# Altium schematic sheet Input_MCU.SchDoc: Input_MCU
size 420 x 297 mm; Author: T. Ludemann; SheetNumber: 1; SheetTotal: 4; DocSize: DINA3
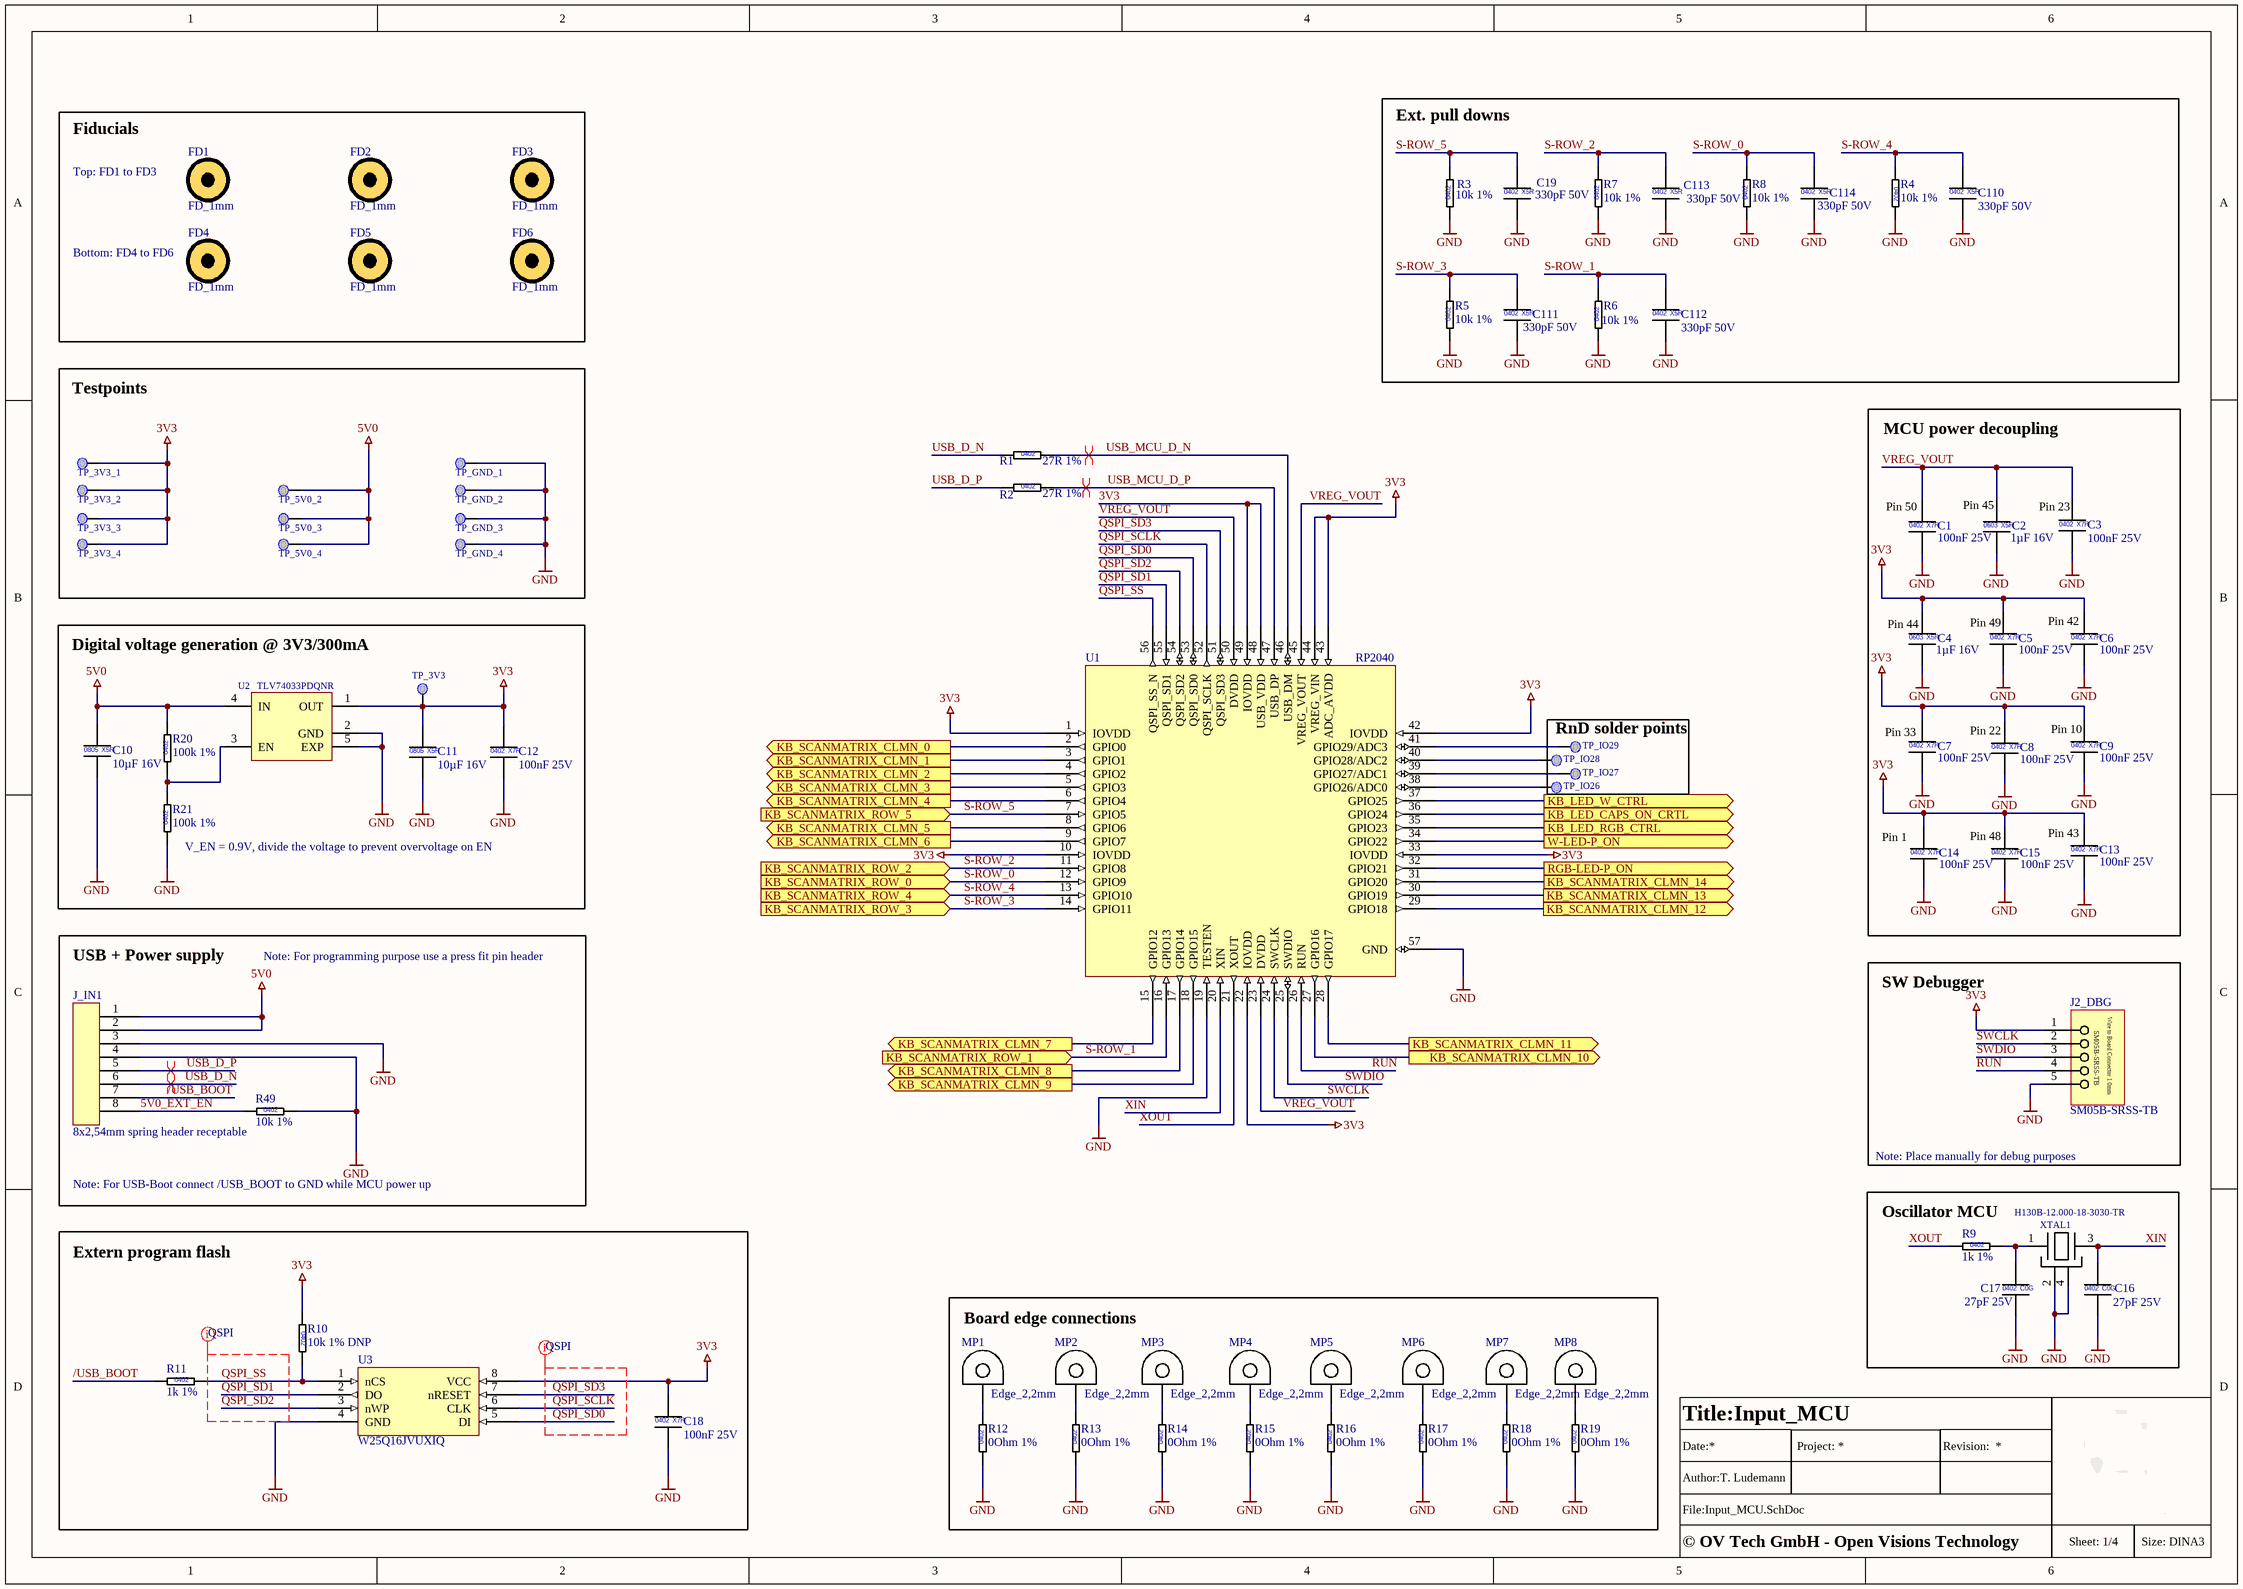
[diagram p0: Input_MCU.SchDoc]

## Parts
?  (no value)  (graphical)
C1  100nF 25V  [CAPC1005X06L]
C2  1µF 16V  [CAPC1608X10L]
C3  100nF 25V  [CAPC1005X06L]
C4  1µF 16V  [CAPC1608X10L]
C5  100nF 25V  [CAPC1005X06L]
C6  100nF 25V  [CAPC1005X06L]
C7  100nF 25V  [CAPC1005X06L]
C8  100nF 25V  [CAPC1005X06L]
C9  100nF 25V  [CAPC1005X06L]
C10  10µF 16V  [CAPC2012X14L]
C11  10µF 16V  [CAPC2012X14L]
C12  100nF 25V  [CAPC1005X06L]
C13  100nF 25V  [CAPC1005X06L]
C14  100nF 25V  [CAPC1005X06L]
C15  100nF 25V  [CAPC1005X06L]
C16  27pF 25V  [CAPC1005X06L]
C17  27pF 25V  [CAPC1005X06L]
C18  100nF 25V  [CAPC1005X06L]
C19  330pF 50V  [CAPC1005X06L]
C110  330pF 50V  [CAPC1005X06L]
C111  330pF 50V  [CAPC1005X06L]
C112  330pF 50V  [CAPC1005X06L]
C113  330pF 50V  [CAPC1005X06L]
C114  330pF 50V  [CAPC1005X06L]
FD1  FD_1mm  [FD_1mm_Copper_3mm_Expansion]  (no BOM)
FD2  FD_1mm  [FD_1mm_Copper_3mm_Expansion]  (no BOM)
FD3  FD_1mm  [FD_1mm_Copper_3mm_Expansion]  (no BOM)
FD4  FD_1mm  [FD_1mm_Copper_3mm_Expansion]  (no BOM)
FD5  FD_1mm  [FD_1mm_Copper_3mm_Expansion]  (no BOM)
FD6  FD_1mm  [FD_1mm_Copper_3mm_Expansion]  (no BOM)
J2_DBG  SM05B-SRSS-TB  [Wire-to-Board SM05B-SRSS-TB]
J_IN1  8x2,54mm spring header receptable  [BOARD-BOARD CON SPRING-LOADED HEADER 8x2,54mm Receptable]  (no BOM)
MP1  Edge_2,2mm  [MP_Keyboard_EdgeMounts_2.2mm]  (no BOM)
MP2  Edge_2,2mm  [MP_Keyboard_EdgeMounts_2.2mm]  (no BOM)
MP3  Edge_2,2mm  [MP_Keyboard_EdgeMounts_2.2mm]  (no BOM)
MP4  Edge_2,2mm  [MP_Keyboard_EdgeMounts_2.2mm]  (no BOM)
MP5  Edge_2,2mm  [MP_Keyboard_EdgeMounts_2.2mm]  (no BOM)
MP6  Edge_2,2mm  [MP_Keyboard_EdgeMounts_2.2mm]  (no BOM)
MP7  Edge_2,2mm  [MP_Keyboard_EdgeMounts_2.2mm]  (no BOM)
MP8  Edge_2,2mm  [MP_Keyboard_EdgeMounts_2.2mm]  (no BOM)
R1  27R 1%  [RESC1005X04L]
R2  27R 1%  [RESC1005X04L]
R3  10k 1%  [RESC1005X04L]
R4  10k 1%  [RESC1005X04L]
R5  10k 1%  [RESC1005X04L]
R6  10k 1%  [RESC1005X04L]
R7  10k 1%  [RESC1005X04L]
R8  10k 1%  [RESC1005X04L]
R9  1k 1%  [RESC1005X04L]
R10  10k 1% DNP  [RESC1005X04L]
R11  1k 1%  [RESC1005X04L]
R12  0Ohm 1%  [RESC1005X04L]
R13  0Ohm 1%  [RESC1005X04L]
R14  0Ohm 1%  [RESC1005X04L]
R15  0Ohm 1%  [RESC1005X04L]
R16  0Ohm 1%  [RESC1005X04L]
R17  0Ohm 1%  [RESC1005X04L]
R18  0Ohm 1%  [RESC1005X04L]
R19  0Ohm 1%  [RESC1005X04L]
R20  100k 1%  [RESC1005X04L]
R21  100k 1%  [RESC1005X04L]
R49  10k 1%  [RESC1005X04L]
TP_3V3  Testpoint 0.75mm  [TP_0.75mm]  (value not drawn)  (no BOM)
TP_3V3_1  Testpoint 0.75mm  [TP_0.75mm]  (value not drawn)  (no BOM)
TP_3V3_2  Testpoint 0.75mm  [TP_0.75mm]  (value not drawn)  (no BOM)
TP_3V3_3  Testpoint 0.75mm  [TP_0.75mm]  (value not drawn)  (no BOM)
TP_3V3_4  Testpoint 0.75mm  [TP_0.75mm]  (value not drawn)  (no BOM)
TP_5V0_2  Testpoint 0.75mm  [TP_0.75mm]  (value not drawn)  (no BOM)
TP_5V0_3  Testpoint 0.75mm  [TP_0.75mm]  (value not drawn)  (no BOM)
TP_5V0_4  Testpoint 0.75mm  [TP_0.75mm]  (value not drawn)  (no BOM)
TP_GND_1  Testpoint 0.75mm  [TP_0.75mm]  (value not drawn)  (no BOM)
TP_GND_2  Testpoint 0.75mm  [TP_0.75mm]  (value not drawn)  (no BOM)
TP_GND_3  Testpoint 0.75mm  [TP_0.75mm]  (value not drawn)  (no BOM)
TP_GND_4  Testpoint 0.75mm  [TP_0.75mm]  (value not drawn)  (no BOM)
TP_IO26  Testpoint 0.75mm  [TP_0.75mm]  (value not drawn)  (no BOM)
TP_IO27  Testpoint 0.75mm  [TP_0.75mm]  (value not drawn)  (no BOM)
TP_IO28  Testpoint 0.75mm  [TP_0.75mm]  (value not drawn)  (no BOM)
TP_IO29  Testpoint 0.75mm  [TP_0.75mm]  (value not drawn)  (no BOM)
U1  RP2040  [QFN40P700X700X90_HS-57M]
U2  TLV74033PDQNR  [X2SON-DFN]
U3  W25Q16JVUXIQ  [SON50P300X60_HS-9N]
XTAL1  H130B-12.000-18-3030-TR  [XTAL_H130B-12.000-18-3030-TR]

## Blocks framed on the sheet
Ext. pull downs: C19 C110-C114 R3-R8
Fiducials: FD1-FD6
Testpoints: TP_3V3_1-TP_3V3_4 TP_5V0_2-TP_5V0_4 TP_GND_1-TP_GND_4
MCU power decoupling: C1-C9 C13-C15
Digital voltage generation @ 3V3/300mA: C10-C12 R20 R21 TP_3V3 U2
RnD solder points: TP_IO26-TP_IO29
USB + Power supply: J_IN1 R49
SW Debugger: J2_DBG
Extern program flash: C18 R10 R11 U3
Oscillator MCU: C16 C17 R9 XTAL1
Board edge connections: MP1-MP8 R12-R19

## Ports
KB_LED_CAPS_ON_CRTL (out), KB_LED_RGB_CTRL (out), KB_LED_W_CTRL (out), KB_SCANMATRIX_CLMN_0 (out), KB_SCANMATRIX_CLMN_1 (out), KB_SCANMATRIX_CLMN_2 (out), KB_SCANMATRIX_CLMN_3 (out), KB_SCANMATRIX_CLMN_4 (out), KB_SCANMATRIX_CLMN_5 (out), KB_SCANMATRIX_CLMN_6 (out), KB_SCANMATRIX_CLMN_7 (out), KB_SCANMATRIX_CLMN_8 (out), KB_SCANMATRIX_CLMN_9 (out), KB_SCANMATRIX_CLMN_10 (out), KB_SCANMATRIX_CLMN_11 (out), KB_SCANMATRIX_CLMN_12 (out), KB_SCANMATRIX_CLMN_13 (out), KB_SCANMATRIX_CLMN_14 (out), KB_SCANMATRIX_ROW_0 (in), KB_SCANMATRIX_ROW_1 (in), KB_SCANMATRIX_ROW_2 (in), KB_SCANMATRIX_ROW_3 (in), KB_SCANMATRIX_ROW_4 (in), KB_SCANMATRIX_ROW_5 (in), RGB-LED-P_ON (out), W-LED-P_ON (out)

## Nets
3V3: C4.1 C5.1 C6.1 C7.1 C8.1 C9.1 C11.1 C12.1 C13.1 C14.1 C15.1 C18.1 J2_DBG.1 R10.1 TP_3V3.TP TP_3V3_1.TP TP_3V3_2.TP TP_3V3_3.TP TP_3V3_4.TP U1.1(IOVDD) U1.10(IOVDD) U1.22(IOVDD) U1.33(IOVDD) U1.42(IOVDD) U1.43(ADC_AVDD) U1.44(VREG_VIN) U1.48(USB_VDD) U1.49(IOVDD) U2.1(OUT) U3.8(VCC)
5V0: C10.1 J_IN1.1 J_IN1.2 R20.2 TP_5V0_2.TP TP_5V0_3.TP TP_5V0_4.TP U2.4(IN)
GND: C1.2 C2.2 C3.2 C4.2 C5.2 C6.2 C7.2 C8.2 C9.2 C10.2 C11.2 C12.2 C13.2 C14.2 C15.2 C16.2 C17.2 C18.2 C19.2 C110.2 C111.2 C112.2 C113.2 C114.2 J2_DBG.5 J_IN1.3 J_IN1.4 R3.1 R4.2 R5.1 R6.1 R7.1 R8.1 R12.1 R13.1 R14.1 R15.1 R16.1 R17.1 R18.1 R19.1 R21.1 R49.2 TP_GND_1.TP TP_GND_2.TP TP_GND_3.TP TP_GND_4.TP U1.19(TESTEN) U1.57(GND) U2.2(GND) U2.5(EXP) U3.4(GND) XTAL1.2 XTAL1.4
5V0_EXT_EN: J_IN1.8 R49.1
/USB_BOOT: J_IN1.7 R11.1
KB_LED_CAPS_ON_CRTL: U1.36(GPIO24) ; port KB_LED_CAPS_ON_CRTL
KB_LED_RGB_CTRL: U1.35(GPIO23) ; port KB_LED_RGB_CTRL
KB_LED_W_CTRL: U1.37(GPIO25) ; port KB_LED_W_CTRL
KB_SCANMATRIX_CLMN_0: U1.2(GPIO0) ; port KB_SCANMATRIX_CLMN_0
KB_SCANMATRIX_CLMN_1: U1.3(GPIO1) ; port KB_SCANMATRIX_CLMN_1
KB_SCANMATRIX_CLMN_2: U1.4(GPIO2) ; port KB_SCANMATRIX_CLMN_2
KB_SCANMATRIX_CLMN_3: U1.5(GPIO3) ; port KB_SCANMATRIX_CLMN_3
KB_SCANMATRIX_CLMN_4: U1.6(GPIO4) ; port KB_SCANMATRIX_CLMN_4
KB_SCANMATRIX_CLMN_5: U1.8(GPIO6) ; port KB_SCANMATRIX_CLMN_5
KB_SCANMATRIX_CLMN_6: U1.9(GPIO7) ; port KB_SCANMATRIX_CLMN_6
KB_SCANMATRIX_CLMN_7: U1.15(GPIO12) ; port KB_SCANMATRIX_CLMN_7
KB_SCANMATRIX_CLMN_8: U1.17(GPIO14) ; port KB_SCANMATRIX_CLMN_8
KB_SCANMATRIX_CLMN_9: U1.18(GPIO15) ; port KB_SCANMATRIX_CLMN_9
KB_SCANMATRIX_CLMN_10: U1.27(GPIO16) ; port KB_SCANMATRIX_CLMN_10
KB_SCANMATRIX_CLMN_11: U1.28(GPIO17) ; port KB_SCANMATRIX_CLMN_11
KB_SCANMATRIX_CLMN_12: U1.29(GPIO18) ; port KB_SCANMATRIX_CLMN_12
KB_SCANMATRIX_CLMN_13: U1.30(GPIO19) ; port KB_SCANMATRIX_CLMN_13
KB_SCANMATRIX_CLMN_14: U1.31(GPIO20) ; port KB_SCANMATRIX_CLMN_14
QSPI_SCLK: U1.52(QSPI_SCLK) U3.6(CLK)
QSPI_SD0: U1.53(QSPI_SD0) U3.5(DI)
QSPI_SD1: U1.55(QSPI_SD1) U3.2(DO)
QSPI_SD2: U1.54(QSPI_SD2) U3.3(nWP)
QSPI_SD3: U1.51(QSPI_SD3) U3.7(nRESET)
QSPI_SS: R10.2 R11.2 U1.56(QSPI_SS_N) U3.1(nCS)
RGB-LED-P_ON: U1.32(GPIO21) ; port RGB-LED-P_ON
RUN: J2_DBG.4 U1.26(RUN)
S-ROW_0: C114.1 R8.2 U1.12(GPIO9) ; port KB_SCANMATRIX_ROW_0
S-ROW_1: C112.1 R6.2 U1.16(GPIO13) ; port KB_SCANMATRIX_ROW_1
S-ROW_2: C113.1 R7.2 U1.11(GPIO8) ; port KB_SCANMATRIX_ROW_2
S-ROW_3: C111.1 R5.2 U1.14(GPIO11) ; port KB_SCANMATRIX_ROW_3
S-ROW_4: C110.1 R4.1 U1.13(GPIO10) ; port KB_SCANMATRIX_ROW_4
S-ROW_5: C19.1 R3.2 U1.7(GPIO5) ; port KB_SCANMATRIX_ROW_5
SWCLK: J2_DBG.2 U1.24(SWCLK)
SWDIO: J2_DBG.3 U1.25(SWDIO)
USB_D_N: J_IN1.6 R1.1
USB_D_P: J_IN1.5 R2.1
USB_MCU_D_N: R1.2 U1.46(USB_DM)
USB_MCU_D_P: R2.2 U1.47(USB_DP)
VREG_VOUT: C1.1 C2.1 C3.1 U1.23(DVDD) U1.45(VREG_VOUT) U1.50(DVDD)
W-LED-P_ON: U1.34(GPIO22) ; port W-LED-P_ON
XIN: C16.1 U1.20(XIN) XTAL1.3
XOUT: R9.1 U1.21(XOUT)
NetC17_1: C17.1 R9.2 XTAL1.1
NetMP1_1: MP1.1 R12.2
NetMP2_1: MP2.1 R13.2
NetMP3_1: MP3.1 R14.2
NetMP4_1: MP4.1 R15.2
NetMP5_1: MP5.1 R16.2
NetMP6_1: MP6.1 R17.2
NetMP7_1: MP7.1 R18.2
NetMP8_1: MP8.1 R19.2
NetR20_1: R20.1 R21.2 U2.3(EN)
NetTP_IO26_TP: TP_IO26.TP U1.38(GPIO26/ADC0)
NetTP_IO27_TP: TP_IO27.TP U1.39(GPIO27/ADC1)
NetTP_IO28_TP: TP_IO28.TP U1.40(GPIO28/ADC2)
NetTP_IO29_TP: TP_IO29.TP U1.41(GPIO29/ADC3)

## Layout directives
differential pair: USB_D_N, USB_D_P, USB_MCU_D_N, USB_MCU_D_P
net class QSPI: QSPI_SCLK, QSPI_SD0, QSPI_SD1, QSPI_SD2, QSPI_SD3, QSPI_SS

## Notes on the sheet
- (near FD1) Top: FD1 to FD3
- (near FD4) Bottom: FD4 to FD6
- (near C1) Pin 50
- (near C2) Pin 45
- (near C3) Pin 23
- (near C4) Pin 44
- (near C5) Pin 49
- (near C6) Pin 42
- (near C8) Pin 22
- (near C9) Pin 10
- (near C7) Pin 33
- (near R21) V_EN = 0.9V, divide the voltage to prevent overvoltage on EN
- (near C14) Pin 1
- (near C15) Pin 48
- (near C13) Pin 43
- Note: For programming purpose use a press fit pin header
- Note: For USB-Boot connect /USB_BOOT to GND while MCU power up
- Note: Place manually for debug purposes
- © OV Tech GmbH - Open Visions Technology
- (in symbol CAP_0402_27pF_50V) 0402; C0G
- (in symbol CAP_0402_100nF_25V) 0402; X7R
- (in symbol CAP_0402_330p_50V) 0402; X5R
- (in symbol CAP_0603_1µ_16V) 0603; X5R
- (in symbol CAP_0805_10µ_16V) 0805; X5R
- (in symbol RES_0402_0R_1%) 0402
- (in symbol RES_0402_1k_1%) 0402
- (in symbol RES_0402_10k_1%) 0402
- (in symbol RES_0402_27R_1%) 0402
- (in symbol RES_0402_100k_1%) 0402
- (in symbol Wire to Board Connector_5pol_SM05B-SRSS-TB) Wire to Board Connector 1.0mm

## Library data of the parts
? = Titleblock_01
C1 C3 C5-C9 C12-C15 C18 = CAP_0402_100nF_25V: Multilayer Ceramic Capacitors MLCC - SMD/SMT 0402 25VDC; Manufacturer 1: KYOCERA AVX; Manufacturer 1 Prt. Nr.: KGM05AR71C104KH; Manufacturer 2 Prt. Nr.: EMK105B7104KV-F; Manufacturer 2: Taiyo Yuden
C2 C4 = CAP_0603_1µ_16V: Multilayer Ceramic Capacitors MLCC - SMD/SMT 0603 16VDC; Manufacturer 1: Samsung Electro-Mechanics; Manufacturer 1 Prt. Nr.: CL05A105KO5NNNC; Manufacturer 2 Prt. Nr.: EMK105BJ105KV-F; Manufacturer 2: Taiyo Yuden
C10 C11 = CAP_0805_10µ_16V: Multilayer Ceramic Capacitors MLCC - SMD/SMT 0603 25VDC; Manufacturer 1: Samsung Electro-Mechanics; Manufacturer 1 Prt. Nr.: CL21A106KOQNNNG; Manufacturer 2 Prt. Nr.: C0805C106K8PAC7210; Manufacturer 2: KEMET
C16 C17 = CAP_0402_27pF_50V: Multilayer Ceramic Capacitors MLCC - SMD/SMT 0402 50VDC; Manufacturer 1: Johanson Technology Inc.; Manufacturer 1 Prt. Nr.: QSCF500Q270G1GV001T; Manufacturer 2 Prt. Nr.: GJM1555C1H270GB01D; Manufacturer 2: Murata Electronics
C19 C110-C114 = CAP_0402_330p_50V: Multilayer Ceramic Capacitors MLCC - SMD/SMT 0402 50VDC; Manufacturer 1: Murata Electronics; Manufacturer 1 Prt. Nr.: GCM1555C1H331FA16J; Manufacturer 2 Prt. Nr.: C0402C331J5GACAUTO; Manufacturer 2: KEMET
FD1-FD6 = MP_Fiducial_1mm: Fiducial with 1 mm radius and 3mm soldermask expansion
J2_DBG = Wire to Board Connector_5pol_SM05B-SRSS-TB: Wire to Board Connector 5pol 1.0mm Pitch; Manufacturer 1: JST; Manufacturer 1 Prt. Nr.: SM05B-SRSS-TB
J_IN1 = Board to Board Connector_816-22-008-10-004101_receptable: 8x2,54 spring header receptable; Manufacturer 1: N/A; Manufacturer Part Number1: N/A
MP1-MP8 = MP_Keyboard_EdgeMount_2.2mm: Edgemount for keyboard
R1 R2 = RES_0402_27R_1%: Thick Film Resistors - SMD 27R 1%; Manufacturer 1: YAGEO; Manufacturer 1 Prt. Nr.: RC0402FR-0727RL; Manufacturer 2 Prt. Nr.: CRGCQ0402F27R; Manufacturer 2: TE Connectivity Passive Product
R3-R8 R10 R49 = RES_0402_10k_1%: Thick Film Resistors - SMD 10k 1%; Manufacturer 1: Vishay / Dale; Manufacturer 1 Prt. Nr.: CRCW040210K0FKEDC; Manufacturer 2 Prt. Nr.: RT0402FRE0710KL; Manufacturer 2: YAGEO
R9 R11 = RES_0402_1k_1%: Thick Film Resistors - SMD 1k 1%; Manufacturer 1: Vishay / Dale; Manufacturer 1 Prt. Nr.: CRCW04021K00FKEDC; Manufacturer 2 Prt. Nr.: RT0402FRE131KL; Manufacturer 2: YAGEO
R12-R19 = RES_0402_0R_1%: Thick Film Resistors - SMD 0OHM 1%; Manufacturer 1: Bourns; Manufacturer 1 Prt. Nr.: CR0402AJ/-000GAS; Manufacturer 2 Prt. Nr.: AC0402FR-070RL; Manufacturer 2: YAGEO
R20 R21 = RES_0402_100k_1%: Thick Film Resistors - SMD 100k 1%; Manufacturer 1: Vishay / Dale; Manufacturer 1 Prt. Nr.: CRCW0402100KFKEDC; Manufacturer 2 Prt. Nr.: RC0402FR-07100KL; Manufacturer 2: YAGEO
U1 = uC_32bit_30IO_RP2040: 32Bit Microcontroller 30IO 133MHz RP2040; Manufacturer 1: Raspberry Pi Foundation; Manufacturer 1 Prt. Nr.: RP2040
U2 = LDO 3.3V_TLV74033PDQNR: LDO voltage regulator 300mA X2SON; Manufacturer 1: Texas Instruments; Manufacturer 1 Prt. Nr.: TLV74033PDQNR
U3 = NOR_Flash_W25Q16JVUXIQ: NOR Flash spiFlash, 3V, 16M-bit, 4Kb Uniform Sector, DTR; Manufacturer 1: Winbond; Manufacturer Part Number 1: W25Q16JVUXIQ
XTAL1 = Crystal_RE-5032_12MHz: CRYSTAL 12.0000MHZ 18PF SMD; Manufacturer 1: Raltron Electronics; Manufacturer 1 Prt. Nr.: H130B-12.000-18-3030-TR